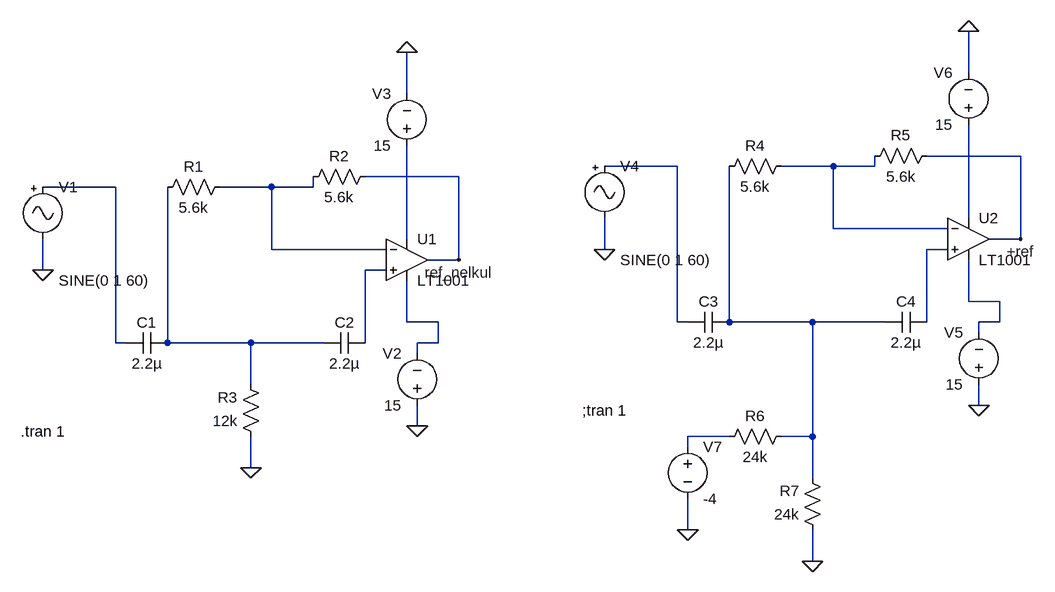
[diagram p0: schematic filter_with_ref.asc]
filter_with_ref.asc, the LTspice schematic file:
Version 4
SHEET 1 1472 692
WIRE 1328 -80 1328 -144
WIRE 464 -48 464 -112
WIRE 1408 48 1264 48
WIRE 880 64 768 64
WIRE 1120 64 1040 64
WIRE 1184 64 1184 48
WIRE 1184 64 1120 64
WIRE 544 80 400 80
WIRE 16 96 -96 96
WIRE 256 96 176 96
WIRE 320 96 320 80
WIRE 320 96 256 96
WIRE 1328 144 1328 0
WIRE 1120 160 1120 64
WIRE 1296 160 1120 160
WIRE 464 176 464 32
WIRE 1408 176 1408 48
WIRE 1408 176 1360 176
WIRE 256 192 256 96
WIRE 432 192 256 192
WIRE 768 192 768 144
WIRE 1296 192 1264 192
WIRE 544 208 544 80
WIRE 544 208 496 208
WIRE -96 224 -96 176
WIRE 432 224 400 224
WIRE 1328 272 1328 208
WIRE 1376 272 1328 272
WIRE 464 304 464 240
WIRE 512 304 464 304
WIRE 880 304 880 64
WIRE 896 304 880 304
WIRE 960 304 960 64
WIRE 1088 304 960 304
WIRE 1200 304 1088 304
WIRE 1264 304 1264 192
WIRE 1376 304 1376 272
WIRE 1376 304 1344 304
WIRE 1344 320 1344 304
WIRE 16 336 16 96
WIRE 32 336 16 336
WIRE 96 336 96 96
WIRE 224 336 96 336
WIRE 336 336 224 336
WIRE 400 336 400 224
WIRE 512 336 512 304
WIRE 512 336 480 336
WIRE 480 352 480 336
WIRE 224 400 224 336
WIRE 1344 432 1344 400
WIRE 480 464 480 432
WIRE 960 480 896 480
WIRE 1088 480 1088 304
WIRE 1088 480 1040 480
WIRE 896 496 896 480
WIRE 224 528 224 480
WIRE 1088 544 1088 480
WIRE 896 624 896 576
WIRE 1088 672 1088 624
FLAG -96 224 0
FLAG 224 528 0
FLAG 464 -112 0
FLAG 480 464 0
FLAG 768 192 0
FLAG 1328 -144 0
FLAG 1344 432 0
FLAG 1088 672 0
FLAG 896 624 0
FLAG 544 208 ref_nelkul
FLAG 1408 176 +ref
SYMBOL res 192 80 R90
WINDOW 0 0 56 VBottom 2
WINDOW 3 32 56 VTop 2
SYMATTR InstName R1
SYMATTR Value 5.6k
SYMBOL res 416 64 R90
WINDOW 0 0 56 VBottom 2
WINDOW 3 32 56 VTop 2
SYMATTR InstName R2
SYMATTR Value 5.6k
SYMBOL cap 96 320 R90
WINDOW 0 0 32 VBottom 2
WINDOW 3 32 32 VTop 2
SYMATTR InstName C1
SYMATTR Value 2.2µ
SYMBOL cap 400 320 R90
WINDOW 0 0 32 VBottom 2
WINDOW 3 32 32 VTop 2
SYMATTR InstName C2
SYMATTR Value 2.2µ
SYMBOL Misc\\signal -96 80 R0
WINDOW 3 24 160 Left 2
WINDOW 123 24 132 Left 2
WINDOW 39 0 0 Left 0
SYMATTR InstName V1
SYMATTR Value SINE(0 1 60)
SYMBOL OpAmps\\LT1001 464 144 R0
SYMATTR InstName U1
SYMBOL res 240 496 R180
WINDOW 0 36 76 Left 2
WINDOW 3 36 40 Left 2
SYMATTR InstName R3
SYMATTR Value 12k
SYMBOL res 1056 48 R90
WINDOW 0 0 56 VBottom 2
WINDOW 3 32 56 VTop 2
SYMATTR InstName R4
SYMATTR Value 5.6k
SYMBOL res 1280 32 R90
WINDOW 0 0 56 VBottom 2
WINDOW 3 32 56 VTop 2
SYMATTR InstName R5
SYMATTR Value 5.6k
SYMBOL cap 960 288 R90
WINDOW 0 0 32 VBottom 2
WINDOW 3 32 32 VTop 2
SYMATTR InstName C3
SYMATTR Value 2.2µ
SYMBOL cap 1264 288 R90
WINDOW 0 0 32 VBottom 2
WINDOW 3 32 32 VTop 2
SYMATTR InstName C4
SYMATTR Value 2.2µ
SYMBOL Misc\\signal 768 48 R0
WINDOW 3 24 160 Left 2
WINDOW 123 24 132 Left 2
WINDOW 39 0 0 Left 0
SYMATTR InstName V4
SYMATTR Value SINE(0 1 60)
SYMBOL OpAmps\\LT1001 1328 112 R0
SYMATTR InstName U2
SYMBOL res 1056 464 R90
WINDOW 0 0 56 VBottom 2
WINDOW 3 32 56 VTop 2
SYMATTR InstName R6
SYMATTR Value 24k
SYMBOL res 1104 640 R180
WINDOW 0 36 76 Left 2
WINDOW 3 36 40 Left 2
SYMATTR InstName R7
SYMATTR Value 24k
SYMBOL voltage 896 480 R0
WINDOW 123 0 0 Left 0
WINDOW 39 0 0 Left 0
SYMATTR InstName V7
SYMATTR Value -4
SYMBOL voltage 464 48 R180
WINDOW 0 24 96 Left 2
WINDOW 3 24 16 Left 2
WINDOW 123 0 0 Left 0
WINDOW 39 0 0 Left 0
SYMATTR InstName V3
SYMATTR Value 15
SYMBOL voltage 480 448 R180
WINDOW 0 24 96 Left 2
WINDOW 3 24 16 Left 2
WINDOW 123 0 0 Left 0
WINDOW 39 0 0 Left 0
SYMATTR InstName V2
SYMATTR Value 15
SYMBOL voltage 1344 416 R180
WINDOW 0 24 96 Left 2
WINDOW 3 24 16 Left 2
WINDOW 123 0 0 Left 0
WINDOW 39 0 0 Left 0
SYMATTR InstName V5
SYMATTR Value 15
SYMBOL voltage 1328 16 R180
WINDOW 0 24 96 Left 2
WINDOW 3 24 16 Left 2
WINDOW 123 0 0 Left 0
WINDOW 39 0 0 Left 0
SYMATTR InstName V6
SYMATTR Value 15
TEXT -130 472 Left 2 !.tran 1
TEXT 734 440 Left 2 !;tran 1

The netlist it stands for:
* filter_with_ref.asc
R1 N004 N012 5.6k
R2 ref_nelkul N004 5.6k
C1 N012 N003 2.2µ
C2 N008 N012 2.2µ
V1 N003 0 SINE(0 1 60)
XU1 N008 N004 N006 N010 ref_nelkul LT1001  ; pins In+ In- V+ V- OUT
R3 0 N012 12k
R4 N002 N011 5.6k
R5 +ref N002 5.6k
C3 N011 N001 2.2µ
C4 N007 N011 2.2µ
V4 N001 0 SINE(0 1 60)
XU2 N007 N002 N005 N009 +ref LT1001  ; pins In+ In- V+ V- OUT
R6 N011 N013 24k
R7 0 N011 24k
V7 N013 0 -4
V3 N006 0 15
V2 0 N010 15
V5 0 N009 15
V6 N005 0 15
.tran 1
;tran 1
.lib LTC.lib
.backanno
.end